# Altium schematic sheet 4 USB.SchDoc
size A
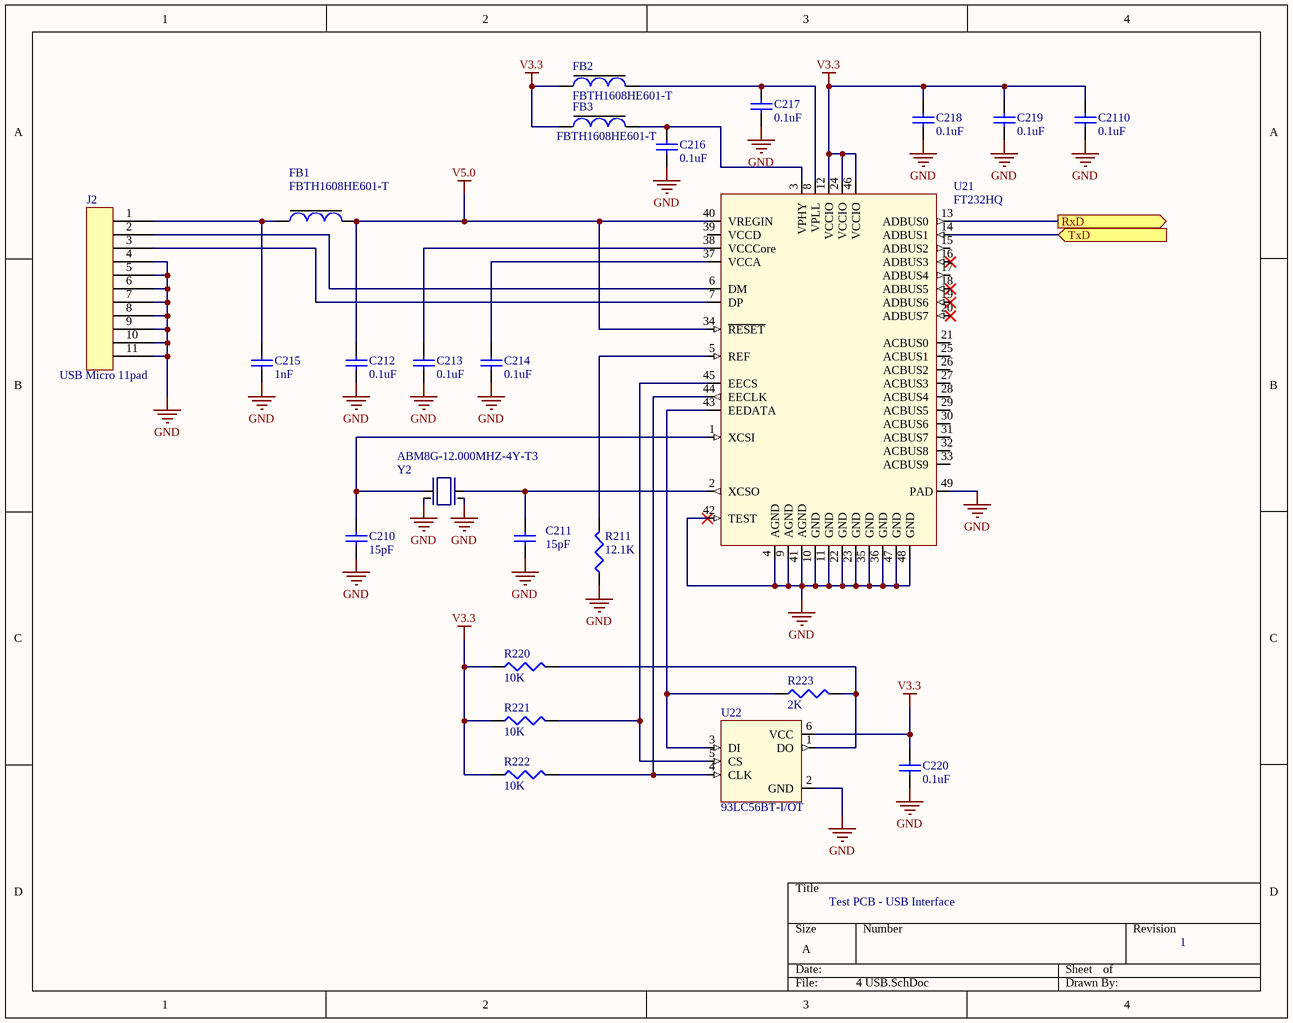
[diagram p0: 4 USB.SchDoc]

## Parts
C210  15pF  [C0603]
C211  15pF  [C0603]
C212  0.1uF  [C0402]
C213  0.1uF  [C0402]
C214  0.1uF  [C0402]
C215  1nF  [C0603]
C216  0.1uF  [C0402]
C217  0.1uF  [C0402]
C218  0.1uF  [C0402]
C219  0.1uF  [C0402]
C220  0.1uF  [C0402]
C2110  0.1uF  [C0402]
FB1  FBTH1608HE601-T  [MPZ1608]
FB2  FBTH1608HE601-T  [MPZ1608]
FB3  FBTH1608HE601-T  [MPZ1608]
J2  USB Micro 11pad  [FCI 10118193]
R211  12.1K  [R0603]
R220  10K  [R0603]
R221  10K  [R0603]
R222  10K  [R0603]
R223  2K  [R0603]
U21  FT232HQ  [QFN50P800X800X100_HS-49N]
U22  93LC56BT-I/OT  [SOT23-6]
Y2  ABM8G-12.000MHZ-4Y-T3  [7M Series XTAL]

## Ports
RxD (out), TxD (in)

## Nets
GND: C210.1 C211.1 C212.1 C213.1 C214.1 C215.1 C216.1 C217.1 C218.1 C219.1 C220.1 C2110.1 J2.4 J2.5 J2.6 J2.7 J2.8 J2.9 J2.10 J2.11 R211.1 U21.4(AGND) U21.9(AGND) U21.10(GND) U21.11(GND) U21.22(GND) U21.23(GND) U21.35(GND) U21.36(GND) U21.41(AGND) U21.42(TEST) U21.47(GND) U21.48(GND) U21.49(PAD) U22.2(GND) Y2.2 Y2.4
V3.3: C218.2 C219.2 C220.2 C2110.2 FB2.1 FB3.1 R220.1 R221.1 R222.1 U21.12(VCCIO) U21.24(VCCIO) U21.46(VCCIO) U22.6(VCC)
V5.0: C212.2 FB1.2 U21.34(~{RESET}) U21.40(VREGIN)
RxD: U21.13(ADBUS0) ; port RxD
TxD: U21.14(ADBUS1) ; port TxD
NetC210_2: C210.2 U21.1(XCSI) Y2.1
NetC211_2: C211.2 U21.2(XCSO) Y2.3
NetC213_2: C213.2 U21.38(VCCCore)
NetC214_2: C214.2 U21.37(VCCA)
NetC215_2: C215.2 FB1.1 J2.1
NetC216_2: C216.2 FB3.2 U21.3(VPHY)
NetC217_2: C217.2 FB2.2 U21.8(VPLL)
NetJ2_2: J2.2 U21.6(DM)
NetJ2_3: J2.3 U21.7(DP)
NetR211_2: R211.2 U21.5(REF)
NetR220_2: R220.2 R223.2 U22.1(DO)
NetR221_2: R221.2 U21.45(EECS) U22.5(CS)
NetR222_2: R222.2 U21.44(EECLK) U22.4(CLK)
NetR223_1: R223.1 U21.43(EEDATA) U22.3(DI)

Not connected (* = marked no-connect by the designer): U21 15(ADBUS2) 16(ADBUS3)* 17(ADBUS4) 18(ADBUS5)* 19(ADBUS6)* 20(ADBUS7)* 21(ACBUS0) 25(ACBUS1) 26(ACBUS2) 27(ACBUS3) 28(ACBUS4) 29(ACBUS5) 30(ACBUS6) 31(ACBUS7) 32(ACBUS8) 33(ACBUS9) 39(VCCD)

## Notes on the sheet
- Test PCB - USB Interface
- 1

## Library data of the parts
C210-C220 C2110 = Cap SM: Capacitor, SM; Published: 8-Jun-2000; LatestRevisionDate: 29-May-2009; LatestRevisionNote: IPC-7351 Footprint Added.; PackageReference: C1206; Publisher: Altium Limited; PackageDescription: Chip Capacitor
  C210 C211: Value: 15pF
  C212-C214 C216-C220 C2110: Value: 0.1uF
  C215: Value: 1nF
FB1-FB3 = Ferrite Bead
R211 R220-R223 = Res SM: Resistor; Published: 8-Jun-2000; LatestRevisionDate: 29-May-2009; LatestRevisionNote: IPC-7351 Footprint Added.; PackageReference: J1-0603; Publisher: Altium Limited; PackageDescription: Chip Resistor
  R211: Value: 12.1K
  R220-R222: Value: 10K
  R223: Value: 2K
U21 = FT232HQ: USB interface
Y2 = Crystal 4 Terminal